# EAGLE design midi2cv.2.1.pnl (EAGLE 7.5.0)
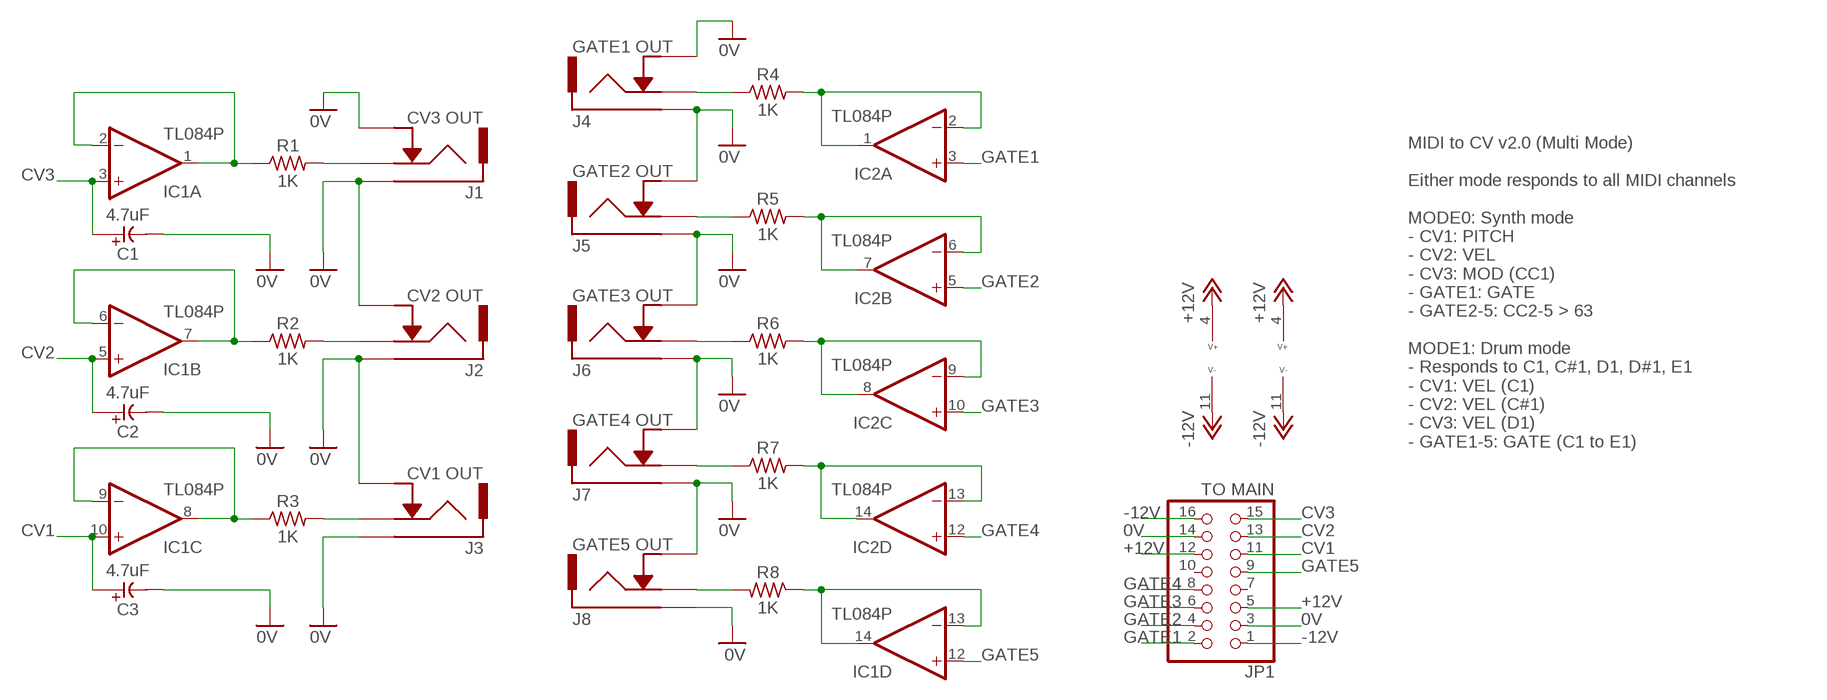
[diagram p0: schematic, sheet 1]

## Parts
C1  4.7uF  CE-USE2-5  [E2-5]
C2  4.7uF  CE-USE2-5  [E2-5]
C3  4.7uF  CE-USE2-5  [E2-5]
IC1  TL084P  [DIL14]
IC2  TL084P  [DIL14]
J1  CV3 OUT  ACJM-MV35-2S  [ACJM-MV35-2S]
J2  CV2 OUT  ACJM-MV35-2S  [ACJM-MV35-2S]
J3  CV1 OUT  ACJM-MV35-2S  [ACJM-MV35-2S]
J4  GATE1 OUT  ACJM-MV35-2S  [ACJM-MV35-2S]
J5  GATE2 OUT  ACJM-MV35-2S  [ACJM-MV35-2S]
J6  GATE3 OUT  ACJM-MV35-2S  [ACJM-MV35-2S]
J7  GATE4 OUT  ACJM-MV35-2S  [ACJM-MV35-2S]
J8  GATE5 OUT  ACJM-MV35-2S  [ACJM-MV35-2S]
JP1  TO MAIN  PINHD-2X8  [2X08]
R1  1K  R0309/10  [0309/10]
R2  1K  R0309/10  [0309/10]
R3  1K  R0309/10  [0309/10]
R4  1K  R0309/10  [0309/10]
R5  1K  R0309/10  [0309/10]
R6  1K  R0309/10  [0309/10]
R7  1K  R0309/10  [0309/10]
R8  1K  R0309/10  [0309/10]

## Nets
0V: C1.- C2.- C3.- J1.P$1 J1.P$3 J2.P$1 J2.P$3 J3.P$1 J3.P$3 J4.P$1 J4.P$3 J5.P$1 J5.P$3 J6.P$1 J6.P$3 J7.P$1 J7.P$3 J8.P$1 J8.P$3 JP1.3 JP1.14
+12V: IC1.4(P:V+) IC2.4(P:V+) JP1.5 JP1.12
-12V: IC1.11(P:V-) IC2.11(P:V-) JP1.1 JP1.16
CV1: C3.+ IC1.10(C:+IN) JP1.11
CV2: C2.+ IC1.5(B:+IN) JP1.13
CV3: C1.+ IC1.3(A:+IN) JP1.15
GATE1: IC2.3(A:+IN) JP1.2
GATE2: IC2.5(B:+IN) JP1.4
GATE3: IC2.10(C:+IN) JP1.6
GATE4: IC2.12(D:+IN) JP1.8
GATE5: IC1.12(D:+IN) JP1.9
N$2: IC1.1(A:OUT) IC1.2(A:-IN) R1.1
N$3: IC1.6(B:-IN) IC1.7(B:OUT) R2.1
N$4: IC1.8(C:OUT) IC1.9(C:-IN) R3.1
N$7: IC1.13(D:-IN) IC1.14(D:OUT) R8.1
N$21: J4.P$2 R4.1
N$22: J5.P$2 R5.1
N$23: J6.P$2 R6.1
N$24: J7.P$2 R7.1
N$25: J8.P$2 R8.2
N$31: IC2.13(D:-IN) IC2.14(D:OUT) R7.2
N$35: IC2.8(C:OUT) IC2.9(C:-IN) R6.2
N$36: IC2.6(B:-IN) IC2.7(B:OUT) R5.2
N$37: IC2.1(A:OUT) IC2.2(A:-IN) R4.2
N$44: J1.P$2 R1.2
N$45: J2.P$2 R2.2
N$46: J3.P$2 R3.2
Unconnected: JP1.7 JP1.10

## Notes on the sheet
- MIDI to CV v2.0 (Multi Mode)
  
  Either mode responds to all MIDI channels
  
  MODE0: Synth mode 
  - CV1: PITCH
  - CV2: VEL
  - CV3: MOD (CC1)
  - GATE1: GATE
  - GATE2-5: CC2-5 > 63
  
  MODE1: Drum mode
  - Responds to C1, C#1, D1, D#1, E1
  - CV1: VEL (C1)
  - CV2: VEL (C#1)
  - CV3: VEL (D1)
  - GATE1-5: GATE (C1 to E1)

## Library data of the parts
C1-C3 = _common:CE-US: ELECTROLYTIC CAPACITOR, US symbol
IC1 IC2 = _common:TL084: OP AMP
J1-J8 = jacks:ACJM-MV35-2S: Amphenol 3.5mm Jack (Vertical) ACJM-MV35-2S http://ca.mouser.com/Search/ProductDetail.aspx?R=ACJM-MV35-2Svirtualkey52380000virtualkey523-ACJMMV352S
JP1 = pinhead:PINHD-2X8: PIN HEADER
R1-R8 = _common:R: RESISTOR, US symbol

## Board
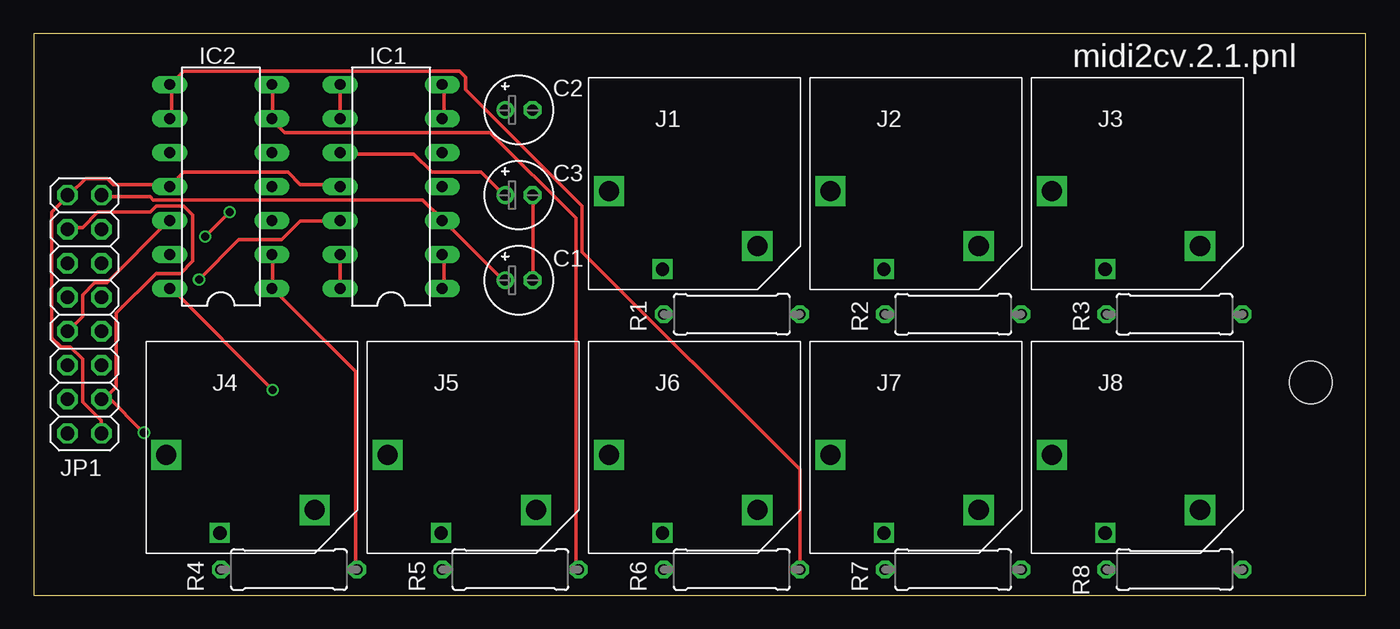
[diagram p1: board, top side]
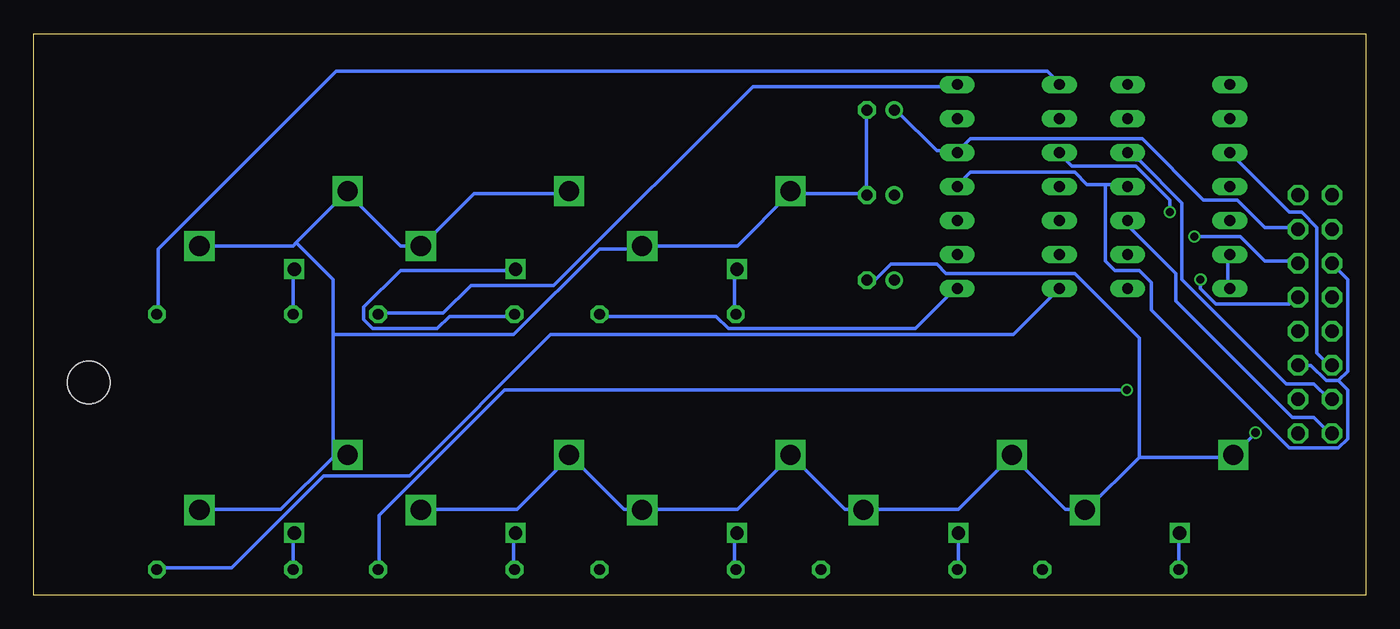
[diagram p2: board, bottom side, seen from below]

Size 99.36 x 41.9 mm. Coordinates in mm from the lower left corner, seen from the top.
Outline: 0,0 99.36,0 99.36,41.9 0,41.9 0,0
Copper layers (1*16): Top 0.035mm / dielectric 1.5mm / Bottom 0.035mm
Design rules "default *": minimum track width 6mil, minimum drill 12mil, track to track 6mil, track to pad 6mil, pad to pad 6mil, via to via 6mil, smd to smd 0mil, copper to edge 10mil, drill to drill 10mil, minimum pad ring 10mil, minimum via ring 6mil, stop-mask expansion 2mil, vias tented up to drill 100mil, thermal gap 10mil
Holes 3.2 mm at 95.25,15.88

### Footprints (pad centres in the part's own frame; a part is rotated, then mirrored left to right if it is on the bottom)
E2-5 = drill 0.813 pad 1.27: + -1.016,0 | drill 0.813 pad 1.27 octagon: - 1.016,0
DIL14 = drill 0.813 long: 1 -7.62,-3.81; 2 -5.08,-3.81; 3 -2.54,-3.81; 4 0,-3.81; 5 2.54,-3.81; 6 5.08,-3.81; 7 7.62,-3.81; 8 7.62,3.81; 9 5.08,3.81; 10 2.54,3.81; 11 0,3.81; 12 -2.54,3.81; 13 -5.08,3.81; 14 -7.62,3.81
ACJM-MV35-2S = drill 1.5 square: P$1 0,0; P$3 -11.05,4.11 | drill 1 square: P$2 -7.07,-1.71
2X08 = drill 1.016 octagon: 1 -8.89,-1.27; 2 -8.89,1.27; 3 -6.35,-1.27; 4 -6.35,1.27; 5 -3.81,-1.27; 6 -3.81,1.27; 7 -1.27,-1.27; 8 -1.27,1.27; 9 1.27,-1.27; 10 1.27,1.27; 11 3.81,-1.27; 12 3.81,1.27; 13 6.35,-1.27; 14 6.35,1.27; 15 8.89,-1.27; 16 8.89,1.27
0309/10 = drill 0.813 octagon: 1 -5.08,0; 2 5.08,0

### Placement (x,y rotation side)
C1  36.2,23.5 0 top
C2  36.2,36.2 0 top
C3  36.2,29.84 0 top
IC1  26.67,30.48 90 top
IC2  13.97,30.48 90 top
J1  53.98,26.04 0 top
J2  70.48,26.04 0 top
J3  87,26.04 0 top
J4  20.95,6.35 0 top
J5  37.47,6.35 0 top
J6  53.98,6.35 0 top
J7  70.48,6.35 0 top
J8  87,6.35 0 top
JP1  3.81,20.95 90 top
R1  52.07,20.95 180 top
R2  68.58,20.95 180 top
R3  85.09,20.95 180 top
R4  19.05,1.91 0 top
R5  35.56,1.91 0 top
R6  52.07,1.91 0 top
R7  68.58,1.91 0 top
R8  85.09,1.91 180 top

### Tracks (layer width: path | path; a pad name or v marks a point on that pad's centre or on a via)
0V  (via drill 0.61)
  Top 0.254: C1.- 37.26,23.55 37.26,29.72 C3.- | 5.49,14.86 5.26,14.63 JP1.3 5.49,14.86 | 5.49,14.86 6.17,15.54 6.17,21.03 9.14,24 10.97,24 11.89,24.92 11.89,28.35 11.2,29.03 9.14,29.03 8.69,28.57 4.8,28.57 3.66,27.43 2.74,27.43 JP1.14 | v8.23,12.12 5.49,14.86
  Bottom 0.254: 37.26,29.95 37.26,36.12 C2.- | 37.26,29.95 42.75,29.95 J1.P$3 42.98,29.95 46.86,26.06 53.95,26.06 J1.P$1 54.18,25.83 57.15,25.83 63.55,19.43 77.04,19.43 | 37.26,29.95 C3.- | 77.04,10.29 80.92,6.4 86.87,6.4 J8.P$1 | 77.04,10.29 76.12,10.29 J8.P$3 77.04,10.29 | J2.P$3 59.44,29.95 66.52,29.95 70.41,26.06 J2.P$1 70.64,26.06 72.01,26.06 75.89,29.95 J3.P$3 76.12,29.95 79.78,26.29 | 79.78,26.29 80.01,26.06 86.87,26.06 J3.P$1 | 77.04,19.43 77.04,23.55 79.78,26.29 | 77.04,19.43 77.04,10.29 | J7.P$1 70.41,6.4 63.32,6.4 59.44,10.29 J7.P$3 59.21,10.29 55.32,6.4 54.18,6.4 J6.P$1 53.95,6.4 46.86,6.4 42.98,10.29 J6.P$3 42.75,10.29 38.86,6.4 37.49,6.4 J5.P$1 37.26,6.4 30.4,6.4 26.52,10.29 J5.P$3 26.29,10.29 22.4,6.4 21.03,6.4 J4.P$1 20.8,6.4 16.92,10.29 | 16.92,10.29 10.06,10.29 J4.P$3 9.83,10.52 v8.23,12.12 | 16.92,10.29 16.92,19.2 21.72,24 31.32,24 32,24.69 35.43,24.69 36.58,23.55 37.03,23.55 C1.-
+12V
  Bottom 0.254: JP1.5 4.12,17.14 2.97,16 2.06,16 | 2.06,16 1.37,16.69 1.37,23.55 2.52,24.69 JP1.12 | 19.43,30.63 20.8,30.63 21.72,31.55 29.49,31.55 30.4,30.63 IC1.4 | 19.43,30.63 17.83,30.63 IC2.4 | 2.06,16 1.37,15.32 1.37,11.66 2.06,10.97 5.71,10.97 16,21.26 16,23.32 16.92,24.23 18.75,24.23 19.43,24.92 19.43,30.63
-12V
  Top 0.254: IC1.11 22.86,30.63 19.89,30.63 18.97,31.55 11.2,31.55 10.29,30.63 IC2.11 10.06,30.63 5.94,30.63 5.49,31.09 3.89,31.09 2.74,29.95 JP1.16 2.52,29.72 1.37,28.57 1.37,19.2 2.06,18.52 2.74,18.52 3.66,17.6 3.66,14.4 5.03,13.03 5.03,12.12 JP1.1
CV1  (via drill 0.61)
  Top 0.254: IC1.10 22.86,32.92 28.35,32.92 29.72,31.55 33.38,31.55 34.98,29.95 C3.+ | v14.63,28.57 v12.8,26.75
  Bottom 0.254: v12.8,26.75 9.37,26.75 7.54,24.92 5.26,24.92 JP1.11 | v14.63,28.57 14.63,29.49 17.14,32 21.95,32 22.86,32.92 IC1.10
CV2
  Bottom 0.254: C2.+ 34.98,36.12 32,33.15 30.63,33.15 IC1.5 30.4,33.15 29.49,34.06 16.69,34.06 12.12,29.49 9.6,29.49 7.54,27.43 5.26,27.43 JP1.13
CV3
  Top 0.254: C1.+ 34.98,23.55 30.63,27.89 IC1.3 30.4,28.12 29.03,29.49 8.91,29.49 8.69,29.72 5.26,29.72 JP1.15
GATE1
  Bottom 0.254: IC2.3 17.6,27.89 17.6,27.43 14.17,24 14.17,21.95 5.49,13.26 3.89,13.26 2.74,12.12 JP1.2
GATE2
  Bottom 0.254: IC2.5 17.6,32.92 17.14,32.46 16.92,32.46 13.72,29.26 13.72,23.55 5.94,15.77 3.89,15.77 2.74,14.63 JP1.4
GATE3
  Bottom 0.254: IC2.10 5.71,28.57 4.8,28.57 3.66,27.43 3.66,18.06 2.74,17.14 JP1.6
GATE4
  Top 0.254: JP1.8 3.66,20.8 3.66,22.4 4.57,23.32 5.49,23.32 10.06,27.89 IC2.12
GATE5  (via drill 0.61)
  Top 0.254: v12.34,23.55 15.32,26.52 18.52,26.52 19.89,27.89 22.86,27.89 IC1.12
  Bottom 0.254: v12.34,23.55 12.34,22.86 11.2,21.72 5.71,21.72 5.26,22.17 JP1.9
N$2
  Top 0.254: IC1.1 30.63,22.86 30.63,25.38 IC1.2
  Bottom 0.254: R1.1 57.15,20.8 48.46,20.8 47.55,19.89 33.6,19.89 30.63,22.86 IC1.1
N$3
  Top 0.254: IC1.6 30.63,35.66 30.63,37.95 IC1.7
  Bottom 0.254: R2.1 73.61,21.03 68.81,21.03 66.75,23.09 60.58,23.09 45.72,37.95 30.63,37.95 IC1.7
N$4
  Top 0.254: IC1.8 IC1.9
  Bottom 0.254: R3.1 90.07,21.03 90.07,25.83 76.81,39.09 23.77,39.09 22.86,38.18 IC1.8
N$7
  Top 0.254: IC1.13 IC1.14
  Bottom 0.254: IC1.14 26.29,19.43 60.81,19.43 71.32,8.91 77.72,8.91 84.58,2.06 90.07,2.06 R8.1
N$21
  Bottom 0.254: R4.1 13.95,2.06 13.95,4.57 J4.P$2
N$22
  Bottom 0.254: R5.1 30.4,2.06 30.4,4.57 J5.P$2
N$23
  Bottom 0.254: R6.1 47.09,2.06 47.09,4.57 J6.P$2
N$24
  Bottom 0.254: R7.1 63.55,2.06 63.55,4.57 J7.P$2
N$25
  Bottom 0.254: R8.2 80.01,4.57 J8.P$2
N$31  (via drill 0.61)
  Top 0.254: v17.83,15.32 10.29,22.86 IC2.14
  Bottom 0.254: IC2.14 10.29,22.86 10.29,25.38 IC2.13 | v17.83,15.32 64.24,15.32 73.61,5.94 73.61,2.06 R7.2
N$35
  Top 0.254: IC2.9 10.29,35.66 10.29,37.95 IC2.8 10.29,38.18 11.2,39.09 31.77,39.09 32.23,38.63 32.23,37.72 40.92,29.03 40.92,25.6 57.15,9.37 R6.2
N$36
  Top 0.254: IC2.7 17.83,37.95 17.83,35.66 IC2.6 17.83,35.43 18.75,34.52 34.06,34.52 40.46,28.12 40.46,2.06 R5.2
N$37
  Top 0.254: 17.83,22.86 17.83,25.38 IC2.2 | 17.83,22.86 24,16.69 24,2.06 R4.2 | 17.83,22.86 IC2.1
N$44
  Bottom 0.254: R1.2 47.09,21.03 47.09,24.23 J1.P$2
N$45
  Bottom 0.254: R2.2 63.55,20.8 68.35,20.8 69.27,19.89 74.07,19.89 74.75,20.57 74.75,21.49 72.01,24.23 63.55,24.23 J2.P$2
N$46
  Bottom 0.254: R3.2 80.01,24.23 J3.P$2

### Text on the board
tNames: midi2cv.2.1.pnl